# EAGLE schematic sha2017_rev0.1 (EAGLE 6.6.0)
Assembly variants: PRODUCTION

## Sheet 1 of 4
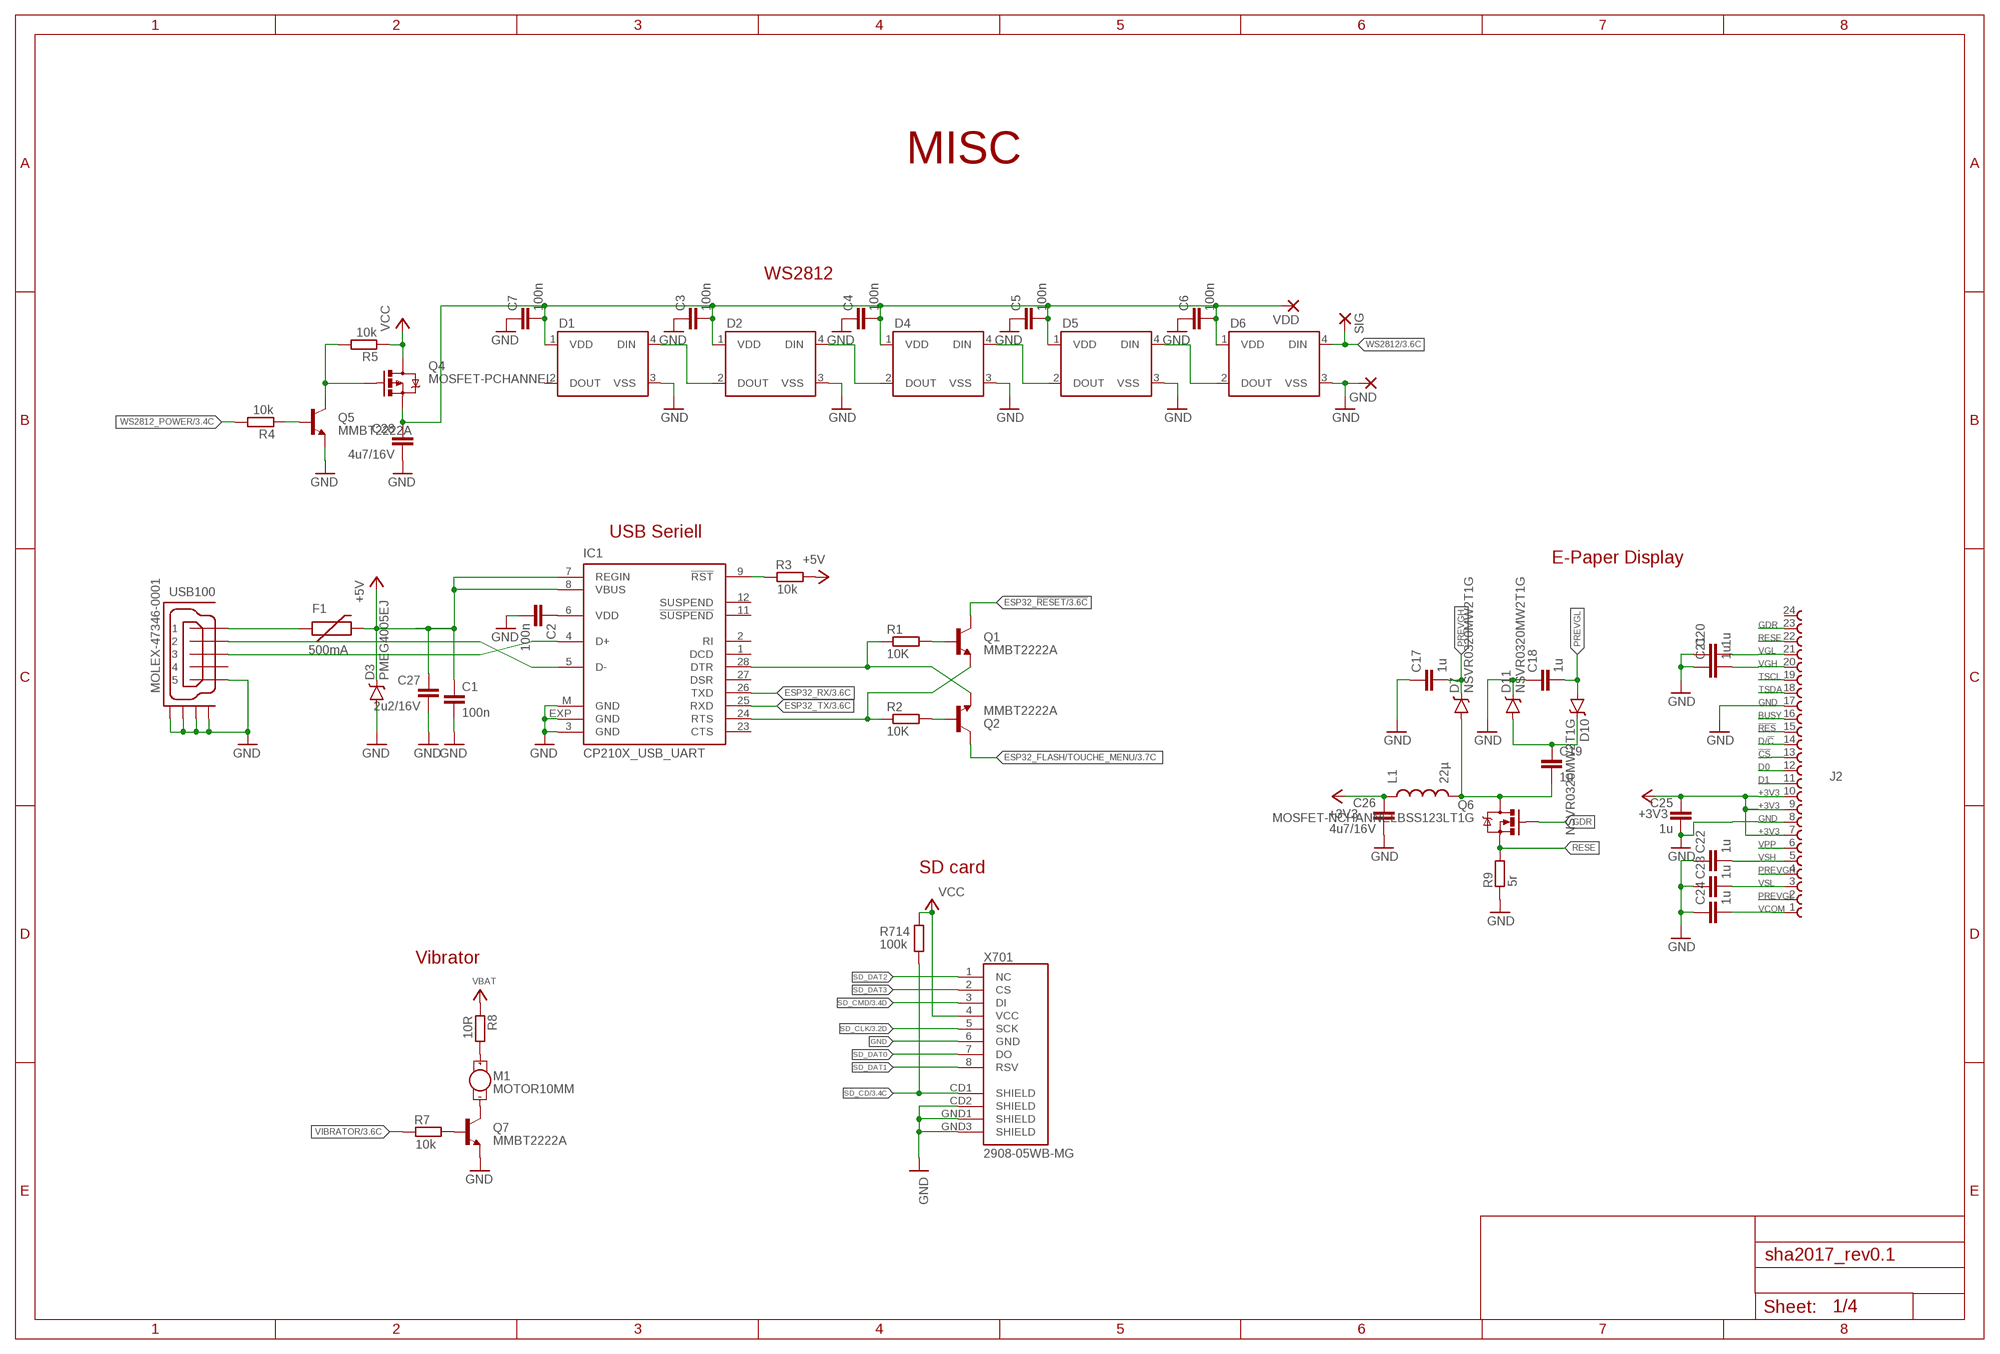
[diagram p0: schematic, sheet 1]

### Parts
C1  100n  C-EUC0603  [C0603]
C2  100n  C-EUC0603  [C0603]
C3  100n  C-EUC0603  [C0603]
C4  100n  C-EUC0603  [C0603]
C5  100n  C-EUC0603  [C0603]
C6  100n  C-EUC0603  [C0603]
C7  100n  C-EUC0603  [C0603]
C17  1u  C-EUC0603  [C0603]
C18  1u  C-EUC0603  [C0603]
C19  1u  C-EUC0603  [C0603]
C20  1u  C-EUC0603  [C0603]
C21  1u  C-EUC0603  [C0603]
C22  1u  C-EUC0603  [C0603]
C23  1u  C-EUC0603  [C0603]
C24  1u  C-EUC0603  [C0603]
C25  1u  C0603-DASHES  [C0603-DASHES]
C26  4u7/16V  C0603-DASHES  [C0603-DASHES]
C27  2u2/16V  C0603-DASHES  [C0603-DASHES]
C28  4u7/16V  C0603-DASHES  [C0603-DASHES]
D1  WS2812B  [WS2812B]
D2  WS2812B  [WS2812B]
D3  PMEG4005EJ  DIODE-SCHOTTKY-PMEG4005EJ  [SOD-323]
D4  WS2812B  [WS2812B]
D5  WS2812B  [WS2812B]
D6  WS2812B  [WS2812B]
D7  NSVR0320MW2T1G  BAT20JFILM  [SOD-323]
D10  NSVR0320MW2T1G  BAT20JFILM  [SOD-323]
D11  NSVR0320MW2T1G  BAT20JFILM  [SOD-323]
F1  500mA  PTCSMD  [PTC-1206]
GND  SMD2  [SMD1,27-2,54]
IC1  CP210X_USB_UART  [MLP28]
J2  68712414022  [68712414022]
L1  22µ  INDUCTOR-  [CDRH3D28]
M1  MOTOR10MM  [VIBE-MOTOR-10MM]
Q1  MMBT2222A  TRANSISTOR_NPNMMBT2222A  [SOT23-3]
Q2  MMBT2222A  TRANSISTOR_NPNMMBT2222A  [SOT23-3]
Q4  MOSFET-PCHANNEL  [SOT23-3]
Q5  MMBT2222A  TRANSISTOR_NPNMMBT2222A  [SOT23-3]
Q6  MOSFET-NCHANNELBSS123LT1G  [SOT23-3]
Q7  MMBT2222A  TRANSISTOR_NPNMMBT2222A  [SOT23-3]
R1  10K  R-EU_R0603  [R0603]
R2  10K  R-EU_R0603  [R0603]
R3  10k  R0603-DASHES  [R0603-DASHES]
R4  10k  R0603-DASHES  [R0603-DASHES]
R5  10k  R0603-DASHES  [R0603-DASHES]
R7  10k  R0603-DASHES  [R0603-DASHES]
R8  10R  R0603-DASHES  [R0603-DASHES]
R9  5r  R0603-DASHES  [R0603-DASHES]
R714  100k  R-EU_R0402  [R0402]
SIG  SMD2  [SMD1,27-2,54]
USB100  MOLEX-47346-0001  [MOLEX-47364-0001]
VDD  SMD2  [SMD1,27-2,54]
X701  2908-05WB-MG  [MICRO-SD-SOCKET-PP]  (not fitted in variant PRODUCTION)

### Nets
!CS: J2.13
!RES: J2.15
+3V3: C25.1 C26.1 J2.7 J2.9 J2.10 L1.1 ; also sheet 2,3,4
+5V [GND/3V3]: C1.1 C27.1 D3.C F1.2 IC1.7(REGIN) IC1.8(VBUS) R3.1 ; also sheet 4
BUSY: J2.16
D0: J2.12
D1: J2.11
D/!C: J2.14
ESP32_!RESET: Q1.3(C) ; also sheet 3
ESP32_FLASH/TOUCHE_MENU: Q2.3(C) ; also sheet 3
ESP32_RX: IC1.26(TXD) ; also sheet 3
ESP32_TX: IC1.25(RXD) ; also sheet 3
GDR: J2.23 Q6.1(G)
GND: C1.2 C2.2 C3.1 C4.1 C5.1 C6.1 C7.1 C17.1 C18.1 C20.1 C21.1 C22.1 C23.1 C24.1 C25.2 C26.2 C27.2 C28.2 D1.3(VSS) D2.3(VSS) D3.A D4.3(VSS) D5.3(VSS) D6.3(VSS) D11.C GND.1(P) IC1.3(GND) IC1.EXP(GND) IC1.M(GND) J2.8 J2.17 Q5.2(E) Q7.2(E) R9.2 USB100.5 USB100.GND1 USB100.GND2 USB100.GND3 USB100.GND4 X701.6(GND) X701.CD2(SHIELD) X701.GND1(SHIELD) X701.GND3(SHIELD) ; also sheet 2,3,4
N$1: D1.4(DIN) D2.2(DOUT)
N$2: D2.4(DIN) D4.2(DOUT)
N$3: D4.4(DIN) D5.2(DOUT)
N$4: D5.4(DIN) D6.2(DOUT)
N$5: C2.1 IC1.6(VDD)
N$8: IC1.9(!RST) R3.2
N$9: Q7.1(B) R7.1
N$10: IC1.24(RTS) Q1.2(E) R2.1
N$11: IC1.28(DTR) Q2.2(E) R1.1
N$13: Q2.1(B) R2.2
N$14: Q1.1(B) R1.2
N$15: Q5.1(B) R4.2
N$16: Q4.1(G) Q5.3(C) R5.1
N$17: C3.2 C4.2 C5.2 C6.2 C7.2 C28.1 D1.1(VDD) D2.1(VDD) D4.1(VDD) D5.1(VDD) D6.1(VDD) Q4.2(S) VDD.1(P)
N$18: M1.- Q7.3(C)
N$19: M1.+ R8.1
N$22: C19.1 D10.C D11.A
N$23: C19.2 D7.A L1.2 Q6.3(D)
N$32 [GND/3V3]: F1.1 USB100.1
PREVGH: C17.2 D7.C J2.4
PREVGL: C18.2 D10.A J2.2
RESE: J2.22 Q6.2(S) R9.1
SD_CD: R714.2 X701.CD1(SHIELD) ; also sheet 3
SD_CLK: X701.5(SCK) ; also sheet 3
SD_CMD: X701.3(DI) ; also sheet 3
SD_DAT0: X701.7(DO)
SD_DAT1: X701.8(RSV)
SD_DAT2: X701.1(NC)
SD_DAT3: X701.2(CS)
TSCL: J2.19
TSDA: J2.18
USB_DN_CON: IC1.5(D-) USB100.2
USB_DP_CON: IC1.4(D+) USB100.3
VBAT [FAT]: R8.2 ; also sheet 4
VCC [FAT]: Q4.3(D) R5.2 R714.1 X701.4(VCC) ; also sheet 4
VCOM: C24.2 J2.1
VGH: C21.2 J2.20
VGL: C20.2 J2.21
VIBRATOR: R7.2 ; also sheet 3
VPP: J2.6
VSH: C22.2 J2.5
VSL: C23.2 J2.3
WS2812: D6.4(DIN) SIG.1(P) ; also sheet 3
WS2812_POWER: R4.1 ; also sheet 3
Unconnected: D1.2(DOUT) IC1.1(DCD) IC1.2(RI) IC1.11(!SUSPEND) IC1.12(SUSPEND) IC1.23(CTS) IC1.27(DSR) J2.24 USB100.4

### Notes on the sheet
- MISC
- WS2812
- USB Seriell
- E-Paper Display
- SD card
- Vibrator

## Sheet 2 of 4
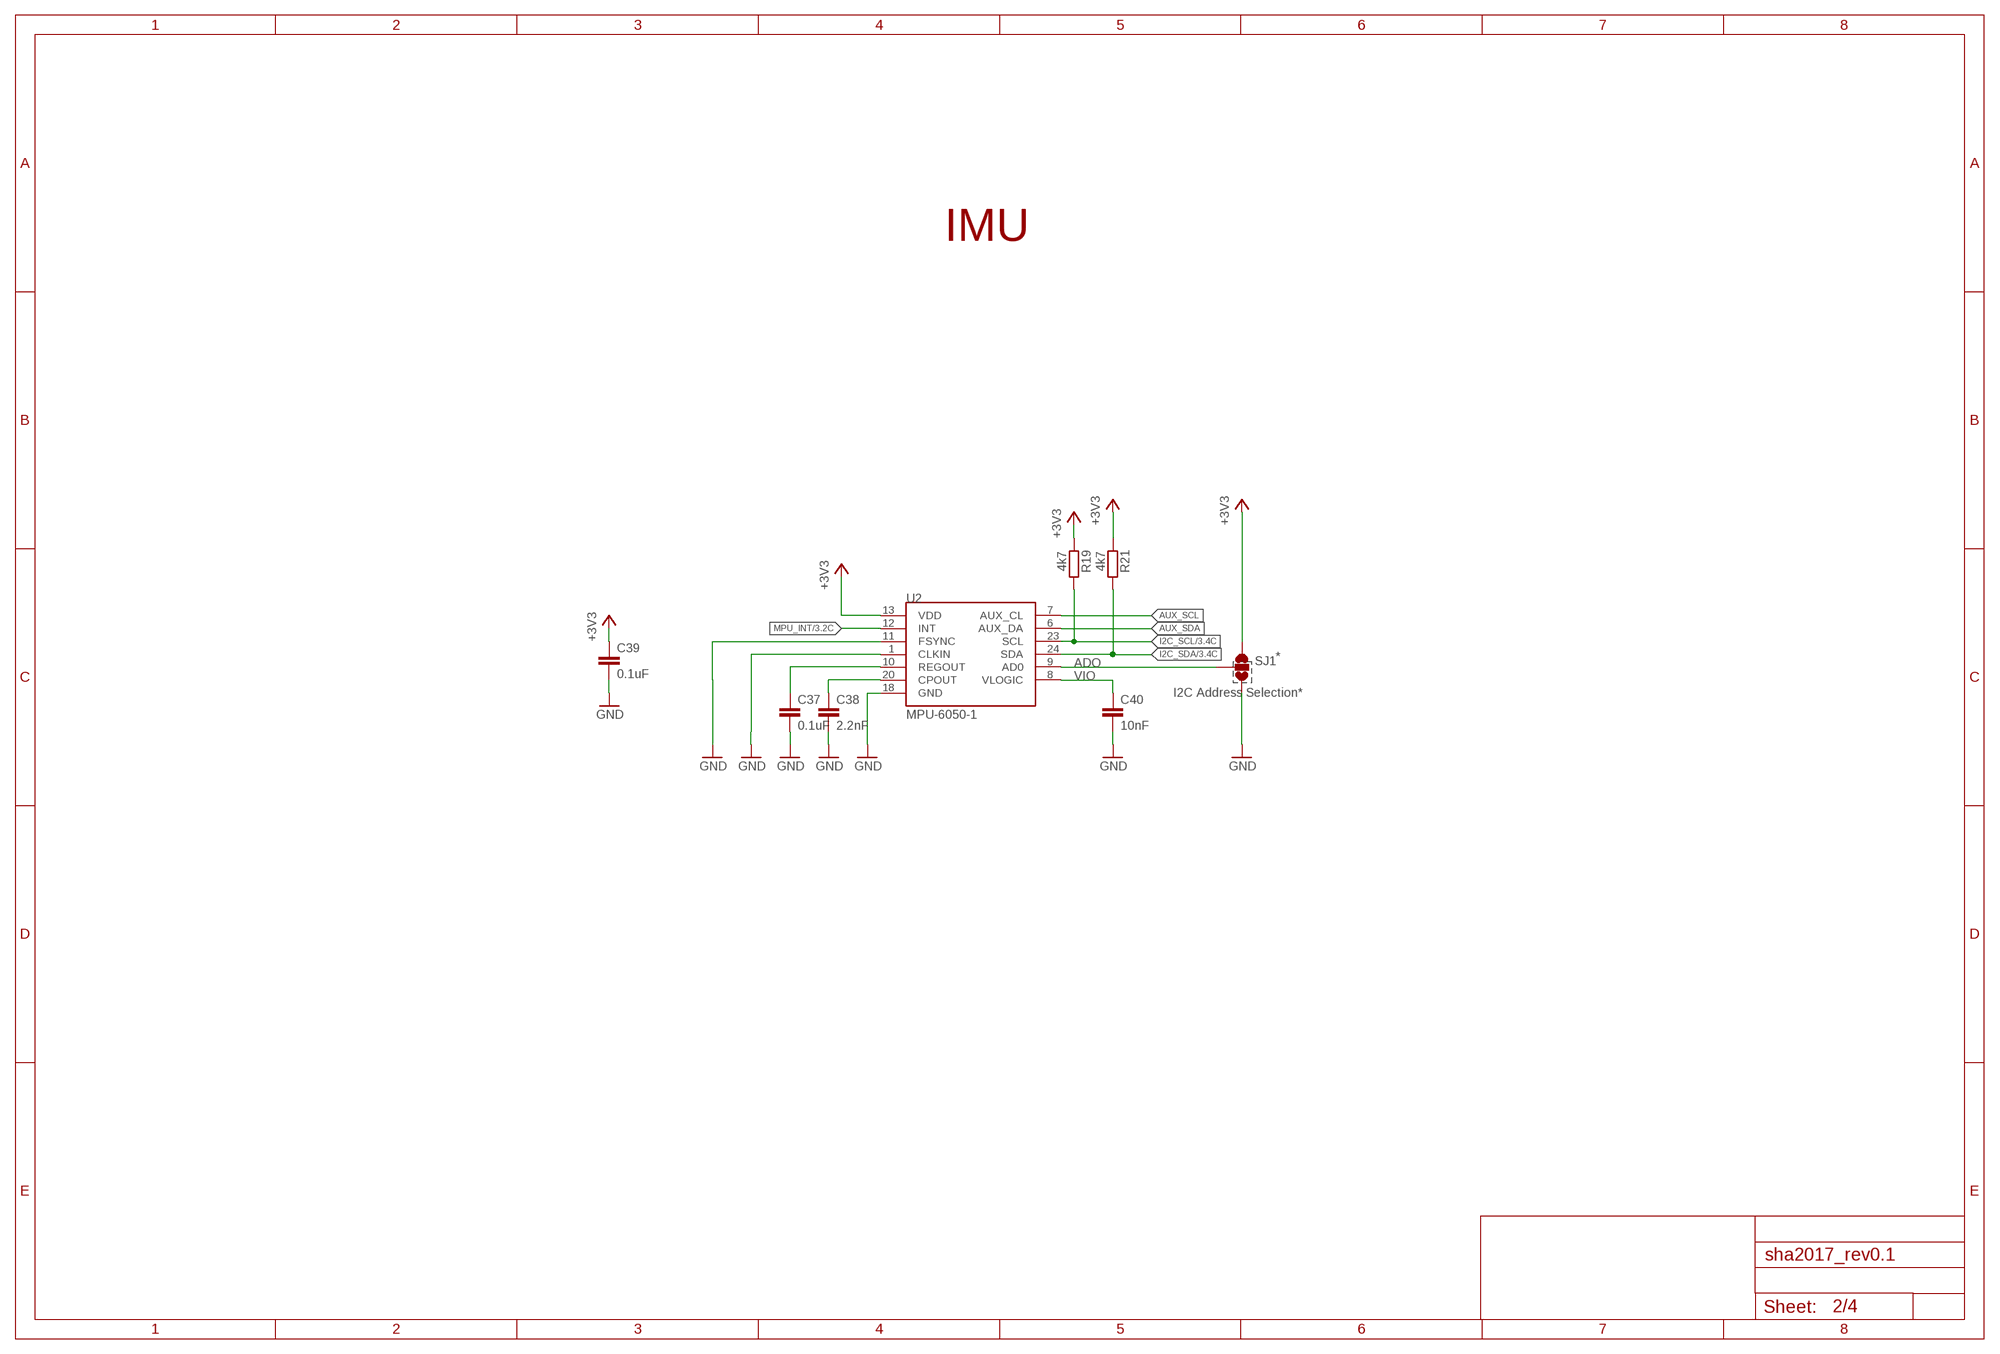
[diagram p1: schematic, sheet 2]

### Parts
C37  0.1uF  CAP0603-CAP  [0603-CAP]
C38  2.2nF  CAP0603-CAP  [0603-CAP]
C39  0.1uF  CAP0603-CAP  [0603-CAP]
C40  10nF  CAP0603-CAP  [0603-CAP]
R19  4k7  R0603-DASHES  [R0603-DASHES]
R21  4k7  R0603-DASHES  [R0603-DASHES]
SJ1  SOLDERJUMPER_2WAYPASTE2&3  [SJ_3_PASTE2&3]
U2  MPU-6050-1  [QFN-24-4MM2]

### Nets
+3V3: C39.1 R19.2 R21.2 SJ1.1 ; also sheet 1,3,4
ADO: SJ1.2 U2.9(AD0)
AUX_SCL: U2.7(AUX_CL)
AUX_SDA: U2.6(AUX_DA)
GND: C37.2 C38.2 C39.2 C40.2 SJ1.3 U2.1(CLKIN) U2.11(FSYNC) U2.18(GND) ; also sheet 1,3,4
I2C_SCL: R19.1 U2.23(SCL) ; also sheet 3
I2C_SDA: R21.1 U2.24(SDA) ; also sheet 3
MPU_INT: U2.12(INT) ; also sheet 3
N$24: C38.1 U2.20(CPOUT)
N$25: C37.1 U2.10(REGOUT)
N$28 [FAT]: U2.13(VDD) ; supply symbol labelled +3V3
VIO: C40.1 U2.8(VLOGIC)

### Notes on the sheet
- IMU
- *
- I2C Address Selection*

## Sheet 3 of 4
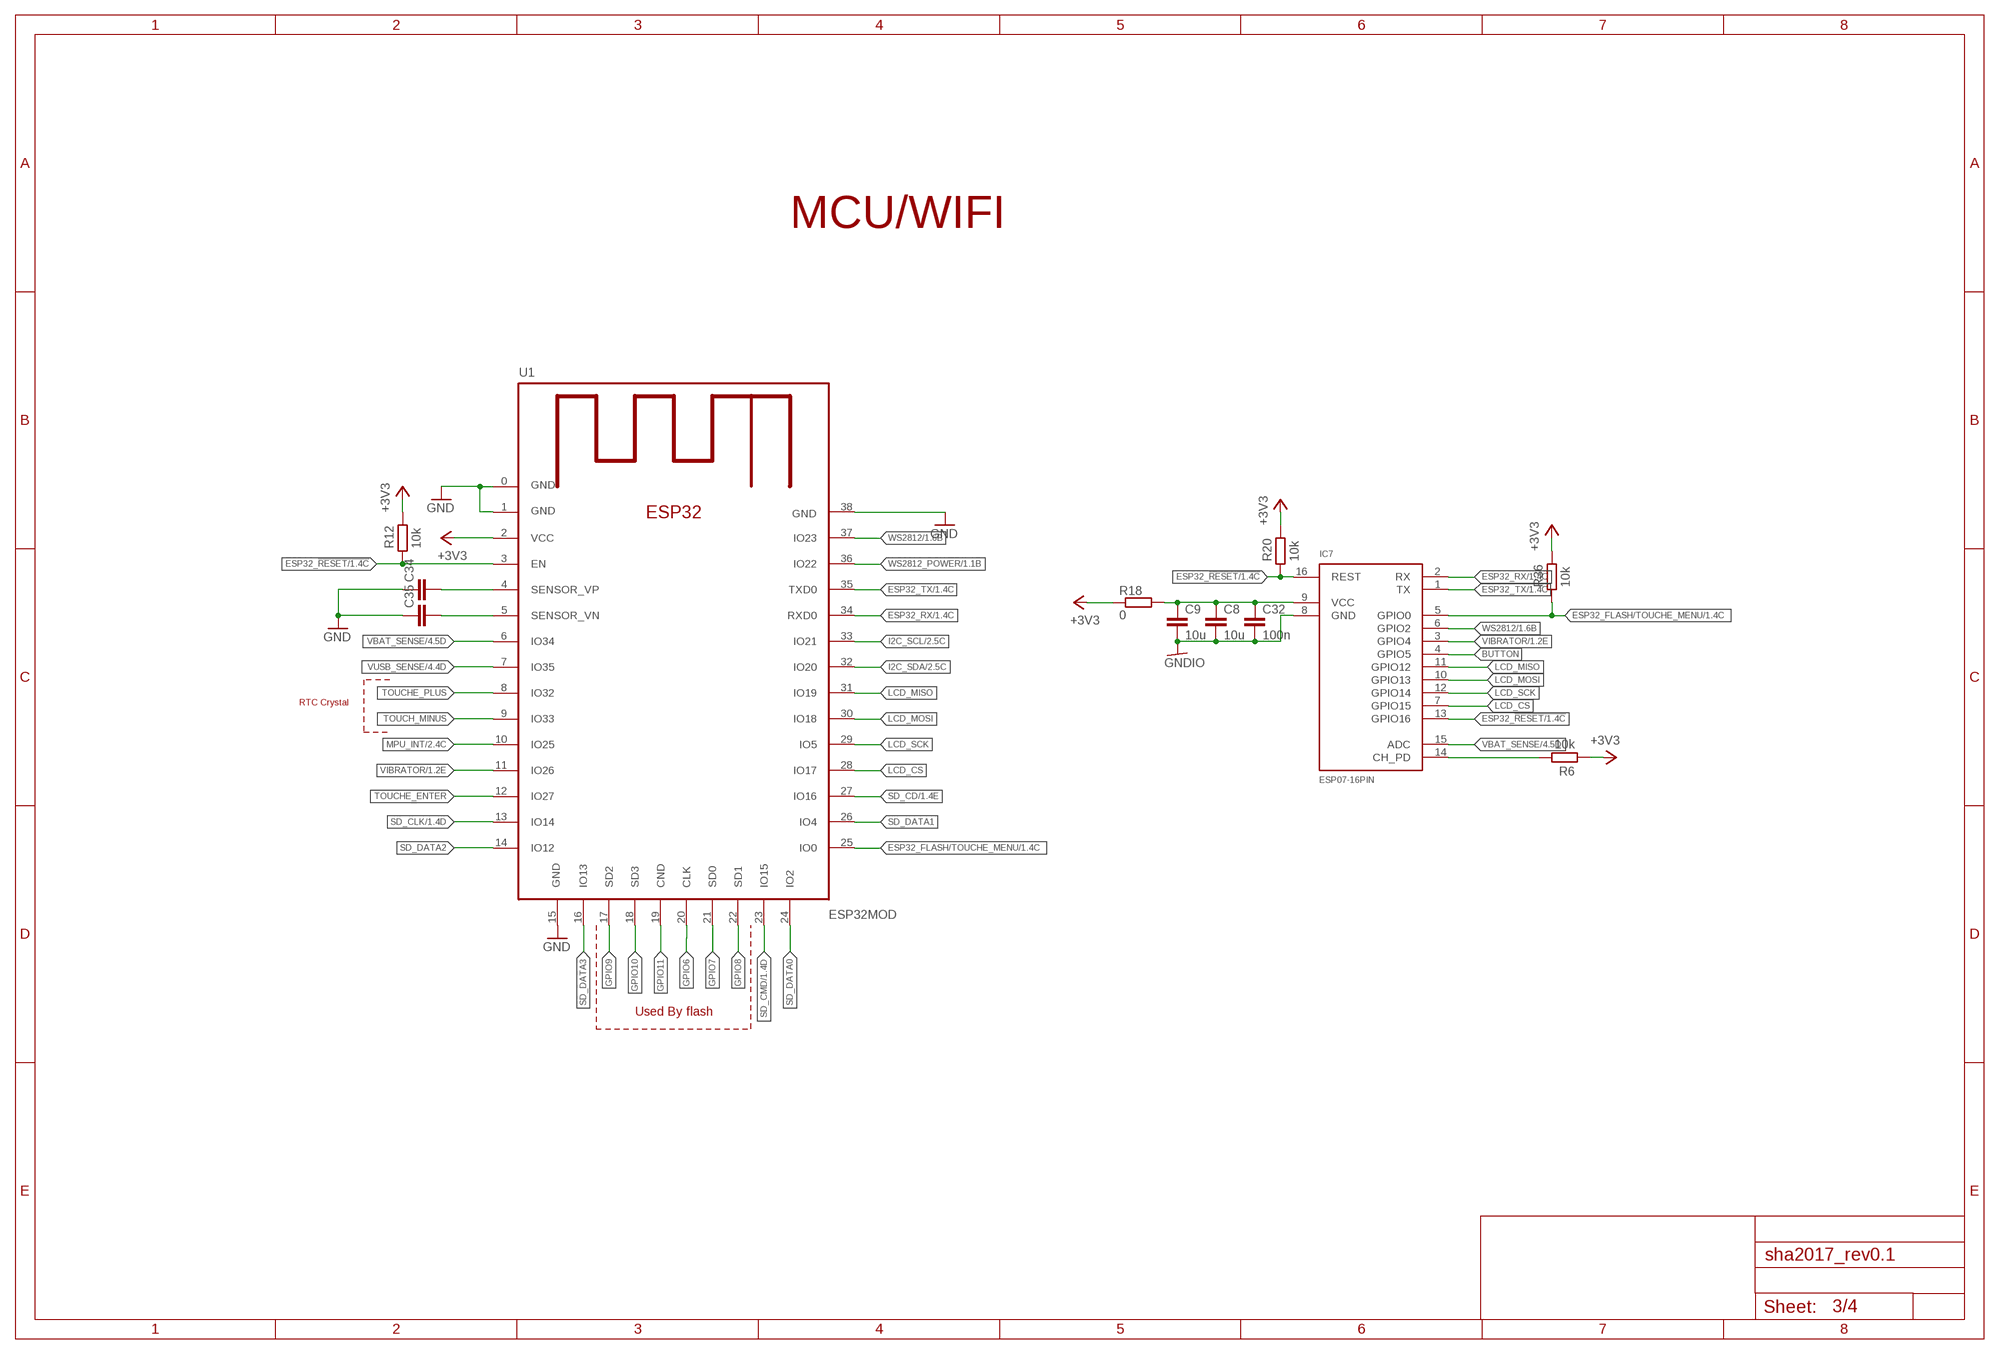
[diagram p2: schematic, sheet 3]

### Parts
C8  10u  C-EUC0603  [C0603]
C9  10u  C-EUC0603  [C0603]
C32  100n  C-EUC0603  [C0603]
C34  C-EUC0603  [C0603]
C35  C-EUC0603  [C0603]
IC7  ESP07-16PIN  [ESP07_16PIN]
R6  10k  R-EU_R0603  [R0603]
R12  10k  R-EU_R0603  [R0603]
R18  0  R-EU_R0603  [R0603]
R20  10k  R-EU_R0603  [R0603]
R36  10k  R-EU_R0603  [R0603]
U1  ESP32MOD  [ESP32MOD]

### Nets
+3V3: R6.2 R12.1 R18.1 R20.1 R36.1 U1.2(VCC) ; also sheet 1,2,4
BUTTON: IC7.4(GPIO5)
ESP32_!RESET: IC7.13(GPIO16) IC7.16(REST) R12.2 R20.2 U1.3(EN) ; also sheet 1
ESP32_FLASH/TOUCHE_MENU: IC7.5(GPIO0) R36.2 U1.25(IO0) ; also sheet 1
ESP32_RX: IC7.2(RX) U1.34(RXD0) ; also sheet 1
ESP32_TX: IC7.1(TX) U1.35(TXD0) ; also sheet 1
GND: C34.1 C35.1 U1.0(GND) U1.1(GND) U1.15(GND) U1.38(GND) ; also sheet 1,2,4
GNDIO: C8.2 C9.2 C32.2 IC7.8(GND)
GPIO6: U1.20(CLK)
GPIO7: U1.21(SD0)
GPIO8: U1.22(SD1)
GPIO9: U1.17(SD2)
GPIO10: U1.18(SD3)
GPIO11: U1.19(CND)
I2C_SCL: U1.33(IO21) ; also sheet 2
I2C_SDA: U1.32(IO20) ; also sheet 2
LCD_CS: IC7.7(GPIO15) U1.28(IO17)
LCD_MISO: IC7.11(GPIO12) U1.31(IO19)
LCD_MOSI: IC7.10(GPIO13) U1.30(IO18)
LCD_SCK: IC7.12(GPIO14) U1.29(IO5)
MPU_INT: U1.10(IO25) ; also sheet 2
N$7: IC7.14(CH_PD) R6.1
N$26: C34.2 U1.4(SENSOR_VP)
N$27: C35.2 U1.5(SENSOR_VN)
N$46: C8.1 C9.1 C32.1 IC7.9(VCC) R18.2
SD_CD: U1.27(IO16) ; also sheet 1
SD_CLK: U1.13(IO14) ; also sheet 1
SD_CMD: U1.23(IO15) ; also sheet 1
SD_DATA0: U1.24(IO2)
SD_DATA1: U1.26(IO4)
SD_DATA2: U1.14(IO12)
SD_DATA3: U1.16(IO13)
TOUCH_MINUS: U1.9(IO33)
TOUCHE_ENTER: U1.12(IO27)
TOUCHE_PLUS: U1.8(IO32)
VBAT_SENSE: IC7.15(ADC) U1.6(IO34) ; also sheet 4
VIBRATOR: IC7.3(GPIO4) U1.11(IO26) ; also sheet 1
VUSB_SENSE: U1.7(IO35) ; also sheet 4
WS2812: IC7.6(GPIO2) U1.37(IO23) ; also sheet 1
WS2812_POWER: U1.36(IO22) ; also sheet 1

### Notes on the sheet
- MCU/WIFI
- RTC Crystal
- Used By flash

## Sheet 4 of 4
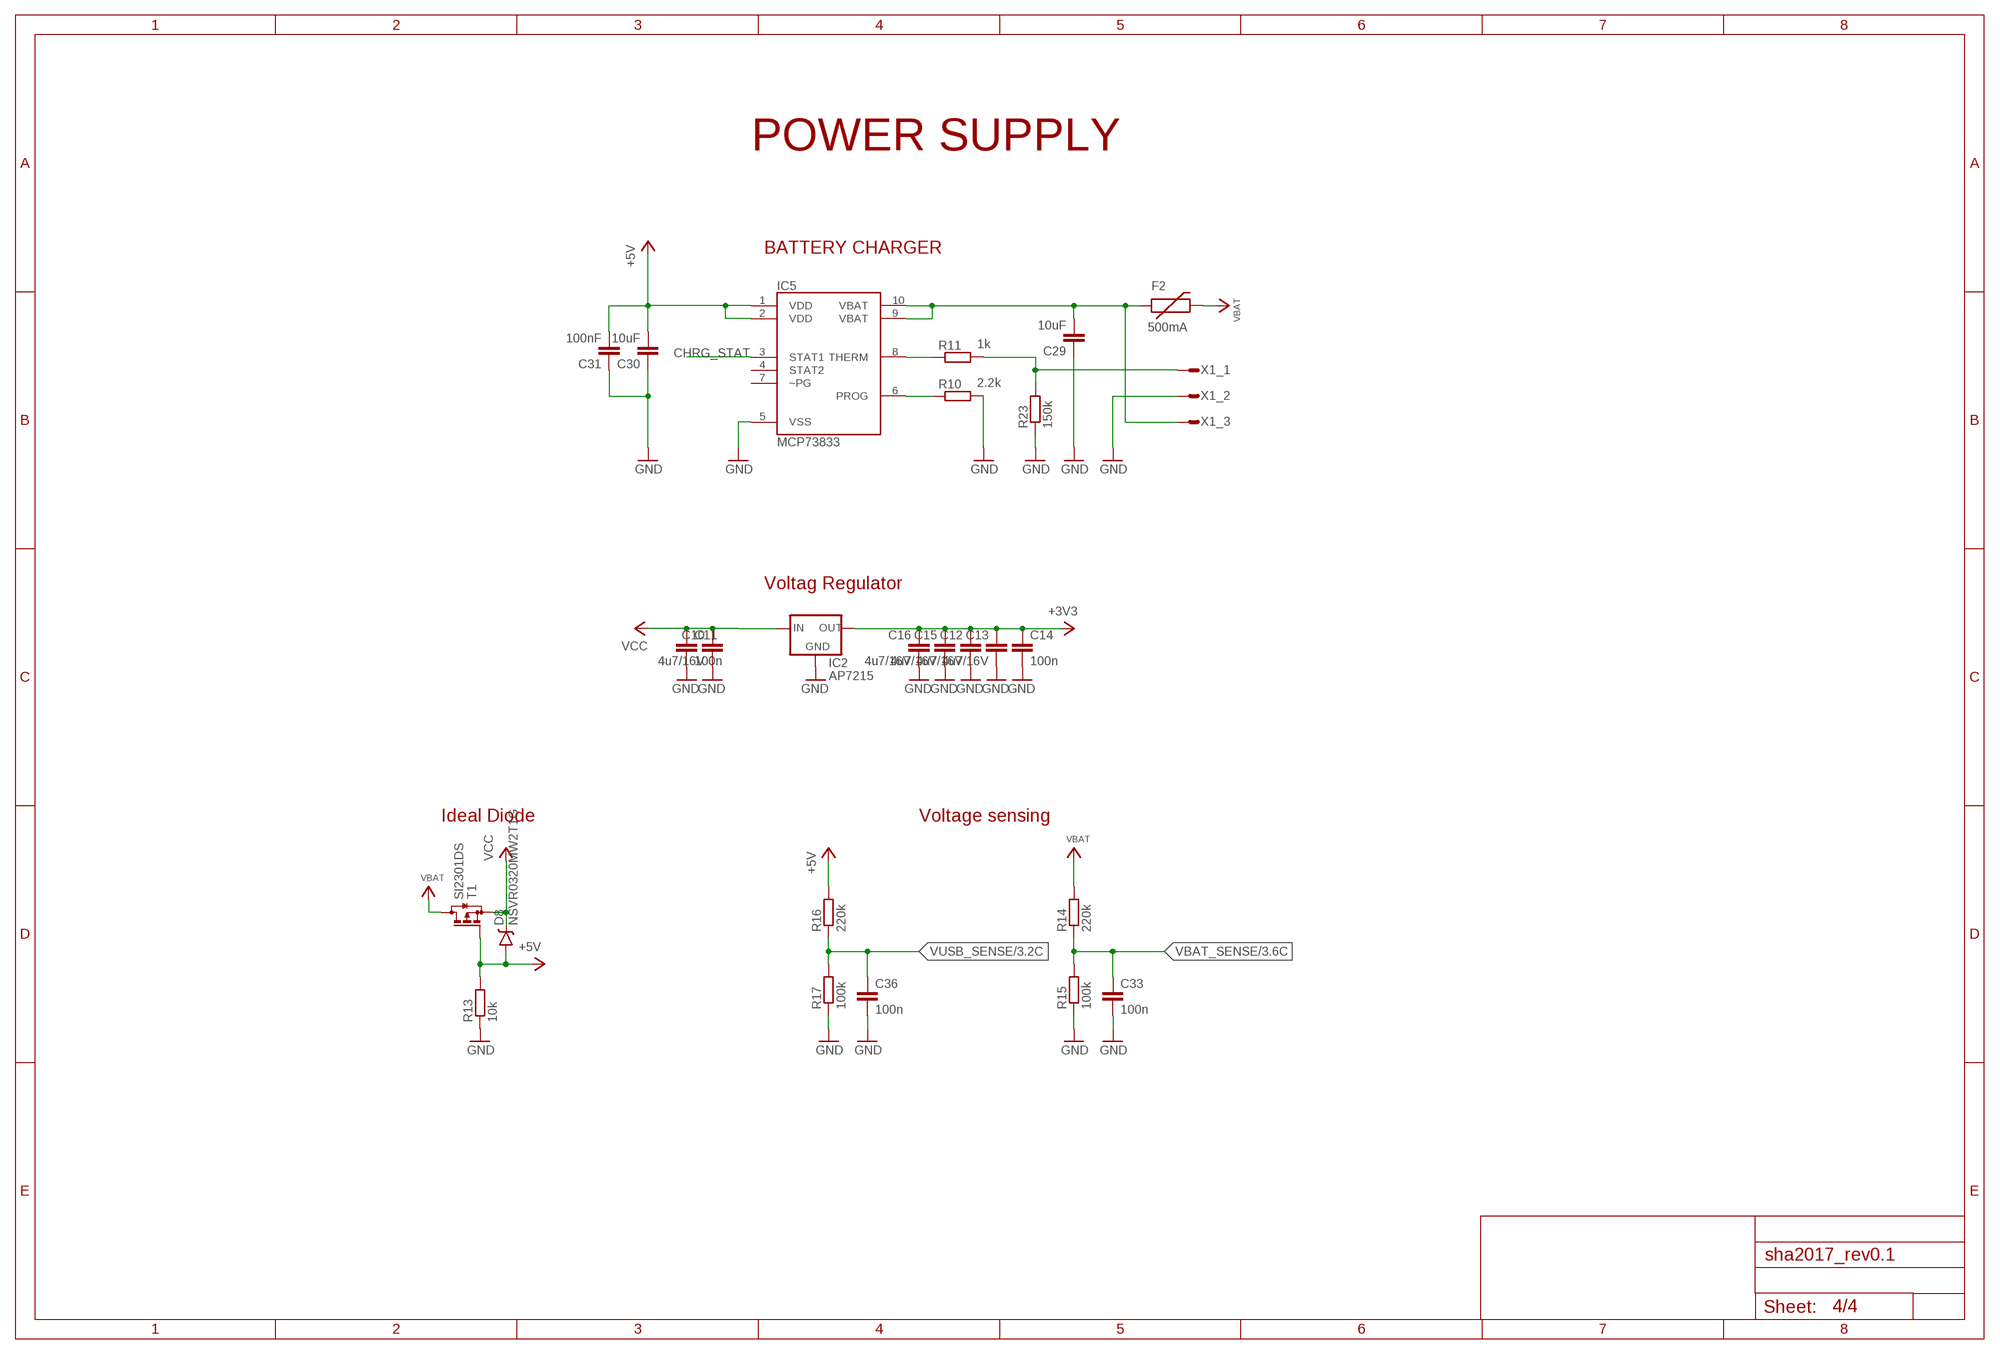
[diagram p3: schematic, sheet 4]

### Parts
C10  4u7/16V  C0603-DASHES  [C0603-DASHES]
C11  100n  C-EUC0603  [C0603]
C12  4u7/16V  C0603-DASHES  [C0603-DASHES]
C13  4u7/16V  C0603-DASHES  [C0603-DASHES]
C14  100n  C-EUC0603  [C0603]
C15  4u7/16V  C0603-DASHES  [C0603-DASHES]
C16  4u7/16V  C0603-DASHES  [C0603-DASHES]
C29  10uF  C-EUC0805K  [C0805K]
C30  10uF  C-EUC0805K  [C0805K]
C31  100nF  C-EUC0402K  [C0402K]
C33  100n  C-EUC0603  [C0603]
C36  100n  C-EUC0603  [C0603]
D8  NSVR0320MW2T1G  BAT20JFILM  [SOD-323]
F2  500mA  PTCSMD  [PTC-1206]
IC2  AP7215  [SOT89]
IC5  MCP73833  [MSOP-10]
R10  2.2k  R-EU_R0603  [R0603]
R11  1k  R-EU_R0603  [R0603]
R13  10k  R-EU_R0603  [R0603]
R14  220k  R-EU_R0603  [R0603]
R15  100k  R-EU_R0603  [R0603]
R16  220k  R-EU_R0603  [R0603]
R17  100k  R-EU_R0603  [R0603]
R23  150k  R-EU_R0603  [R0603]
T1  SI2301DS  BSS84  [SOT23]
X1_  JST-PH3  [JST-PH3]

### Nets
+3V3: C12.1 C13.1 C14.1 C15.1 C16.1 IC2.3(OUT) ; also sheet 1,2,3
+5V [GND/3V3]: C30.2 C31.2 D8.A IC5.1(VDD) IC5.2(VDD) R13.2 R16.2 T1.1(G) ; also sheet 1
CHRG_STAT: IC5.3(STAT1)
GND: C10.2 C11.2 C12.2 C13.2 C14.2 C15.2 C16.2 C29.1 C30.1 C31.1 C33.2 C36.2 IC2.1(GND) IC5.5(VSS) R10.1 R13.1 R15.1 R17.1 R23.1 X1_.2 ; also sheet 1,2,3
N$6 [FAT]: C29.2 F2.1 IC5.9(VBAT) IC5.10(VBAT) X1_.3
N$12: IC5.6(PROG) R10.2
N$20: IC5.8(THERM) R11.2
N$21: R11.1 R23.2 X1_.1
VBAT [FAT]: F2.2 R14.2 T1.3(D) ; also sheet 1
VBAT_SENSE: C33.1 R14.1 R15.2 ; also sheet 3
VCC [FAT]: C10.1 C11.1 D8.C IC2.2(IN) IC2.2@(IN) T1.2(S) ; also sheet 1
VUSB_SENSE: C36.1 R16.1 R17.2 ; also sheet 3
Unconnected: IC5.4(STAT2) IC5.7(~PG)

### Notes on the sheet
- POWER SUPPLY
- BATTERY CHARGER
- Voltag Regulator
- Ideal Diode | Voltage sensing

## Library data of the parts
C1-C7 C11 C14 C17-C24 C29-C31 = rcl:C-EU: CAPACITOR, European symbol
C8 C9 C32-C36 = rcl:C-EU: CAPACITOR, European symbol; OC_FARNELL: unknown
C10 C12 C13 C15 C16 C25-C28 = 00ralf:C0603-DASHES
C37-C40 = SparkFun:CAP: Capacitor Standard 0603 ceramic capacitor, and 0.1" leaded capacitor.
D1 D2 D4-D6 = SparkFun-LED:WS2812B: WS2812B - Intelligent control LED integrated light source Technical Specifications: Power Supply Voltage (VDD): 3.5 to 5.3 V Input Voltage (VI): -0.5 to VDD+0.5 V Operating Junction Temperature (Topt): -25°C to +80°C Storage Temperature Range (Tstg): -55°C to +150°C
D3 = SparkFun-DiscreteSemi:DIODE-SCHOTTKY: Schottky diodes in SFE's production catalog BAT20J 1A 23V 0.62Vf RB751 120mA 40V 0.37Vf PMEG4005EJ 0.5A 40V 0.42Vf MBRA140 1A 40V 0.5Vf B340A 3A 40V SMA; PROD_ID: DIO-10955
D7 D8 D10 D11 = SparkFun-DiscreteSemi:BAT20JFILM: 23V, 1A Schottky diode, SOD-323 package; PROD_ID: DIO-11623; VALUE: BAT20JFILM
F1 F2 = SparkFun-PowerIC:PTC: Resettable Fuse PTC Resettable Fuse. Spark Fun Electronics SKU : COM-08357; PROD_ID: RES-11150
GND SIG VDD = wirepad:SMD2: SMD PAD
IC1 = SparkFun-DigitalIC:CP210X_USB_UART: Single-Chip USB to UART Bridge Source: www.silabs.com .. CP2101.pdf / cp2102.pdf. Spark Fun Electronics SKU : COM-00310
IC2 = badge:AP7215
IC5 = SparkFun:MCP73833: Microchip MCP73833 Stand-alone Linear Li-ion/Li-polymer Charge Management Controller Packages: DFN-10, MSOP-10 Last modified: 8/17/10 Unproven!
IC7 = esp8266modules:ESP07-16PIN; OC_FARNELL: unknown
J2 = EAGLE-FPC_CONNECTOR_AND_FFC_CAB-rev1:68712414022: WR-FPC 0.5mm SMT ZIF Horizontal Top Contact, 24 Pins=>Code : Con_FPC_ZIF_0.50_68712414022 <http://katalog.we-online.de/media/images/eican/Con_FPC_ZIF_0.50_6871xx14022_pf2.jpg> Details see: http://katalog.we-online.de/en/em/687_1xx_140_22 Created 2014-07-09, Karrer Zheng 2014 (C) Würth Elektronik
L1 = SparkFun-Passives:INDUCTOR: Inductors Basic Inductor/Choke - 0603 and 1206. Footprints are not proven and vary greatly between part numbers. SRN6045- 33uH, 20% 1.4A SDR0403-560KL - 56uH, 10%, 500mA RMS/740mA peak
M1 = SparkFun-Electromechanical:MOTOR: Vibration Motor- ROB-08449 Physical dimension and wire connections for this powerful vibration motor. Motor has a self adhesive backing.
Q1 Q2 Q5 Q7 = SparkFun-DiscreteSemi:TRANSISTOR_NPN: Generic NPN BJT MMBT2222A - TRANS-08049 (SOT-23, 1A 40V) MPSA42 - TRANS-09116 (SOT-23, 500mA 300V) MMBT5088LT1G - TRANS-11160 (SOT-23, 50 mA 30V) BC547 - COM-08928 <http://www.sparkfun.com/products/8928> (TO-92 45V 100mA) (1.Collector 2.Base 3.Emitter) 2N3904 - COM-00521 <http://www.sparkfun.com/products/521> (TO-92 40V 200mA) (1.Emitter 2.Base 3.Collector) P2N2222A - COM-12852 <http://www.sparkfun.com/products/12852> (TO-92 40V 600mA) (1.Collector 2.Base 3.Emitter); PROD_ID: TRANS-08049
Q4 = SparkFun-DiscreteSemi:MOSFET-PCHANNEL: Generic PMOSFET IRLML2244 - TRANS-11153 (SOT-23 -20V -4.3A) (1.Gate 2.Source 3.Drain) FQP27P06 - COM-10349 <http://www.sparkfun.com/products/10349> (TO-220 -60V -27A) (1.Gate 2.Source 3.Drain); PROD_ID: TRANS-08285
Q6 = SparkFun-DiscreteSemi:MOSFET-NCHANNEL: Common NMOSFET Parts MFG P/N Store ID Prod ID FDD8780 TRANS-09984 SI7820DN TRANS-11055 FDS6630A IC-08089 2N7002PW TRANS-11151 FQP30N06L COM-10213 TRANS-10060 BSS123LT1G TRANS-08345 BSS138 TRANS-00830 BS170 2N7000; PROD_ID: TRANS-08345
R1 R2 R10 R11 R13-R17 R23 R714 = rcl:R-EU_: RESISTOR, European symbol
R3-R5 R7-R9 R19 R21 = 00ralf:R0603-DASHES
R6 R12 R18 R20 R36 = rcl:R-EU_: RESISTOR, European symbol; OC_FARNELL: unknown
SJ1 = SparkFun:SOLDERJUMPER_2WAY: Solder Jumper 2 way solder jumper
T1 = transistor-small-signal:BSS84: P-CHANNEL MOS FET
U1 = ESP3x:ESP32MOD: ESP32 Module Espressif
U2 = Testing:MPU-6050
USB100 = usb_con-update:MOLEX-47346-0001: MICRO USB B, BOTTOM MOUNT
X1_ = badge:JST-PH3
X701 = con-3m:2908-: 3M Card Connector microSD Normal Polarisation, Push-Push, Surface-Mount, 2900 Series 2908-05WB-MG: Surface mount, right angle Supplier: DigiKey 3M5607CT-ND Source: http://solutions.3m.com/wps/portal/3M/en_US/FP/FireProtection/Products/ProductCatalog/?PC_7_RJH9U5230GE3E02LECFTDQ0R92_nid=GGFDLLB87CbeGKZPW31NMHgl

## Net classes
1 FAT: width 0.2 mm, drill 0.4 mm
2 GND/3V3: width 0.2 mm, drill 0.4 mm